# EasyEDA schematic Sheet_1.json
TITLE: Sheet_1; REV: 1.0; Date: 2025-05-09; Sheet: 1/1; Drawn By: ahmadputracahyo; Company: Your Company
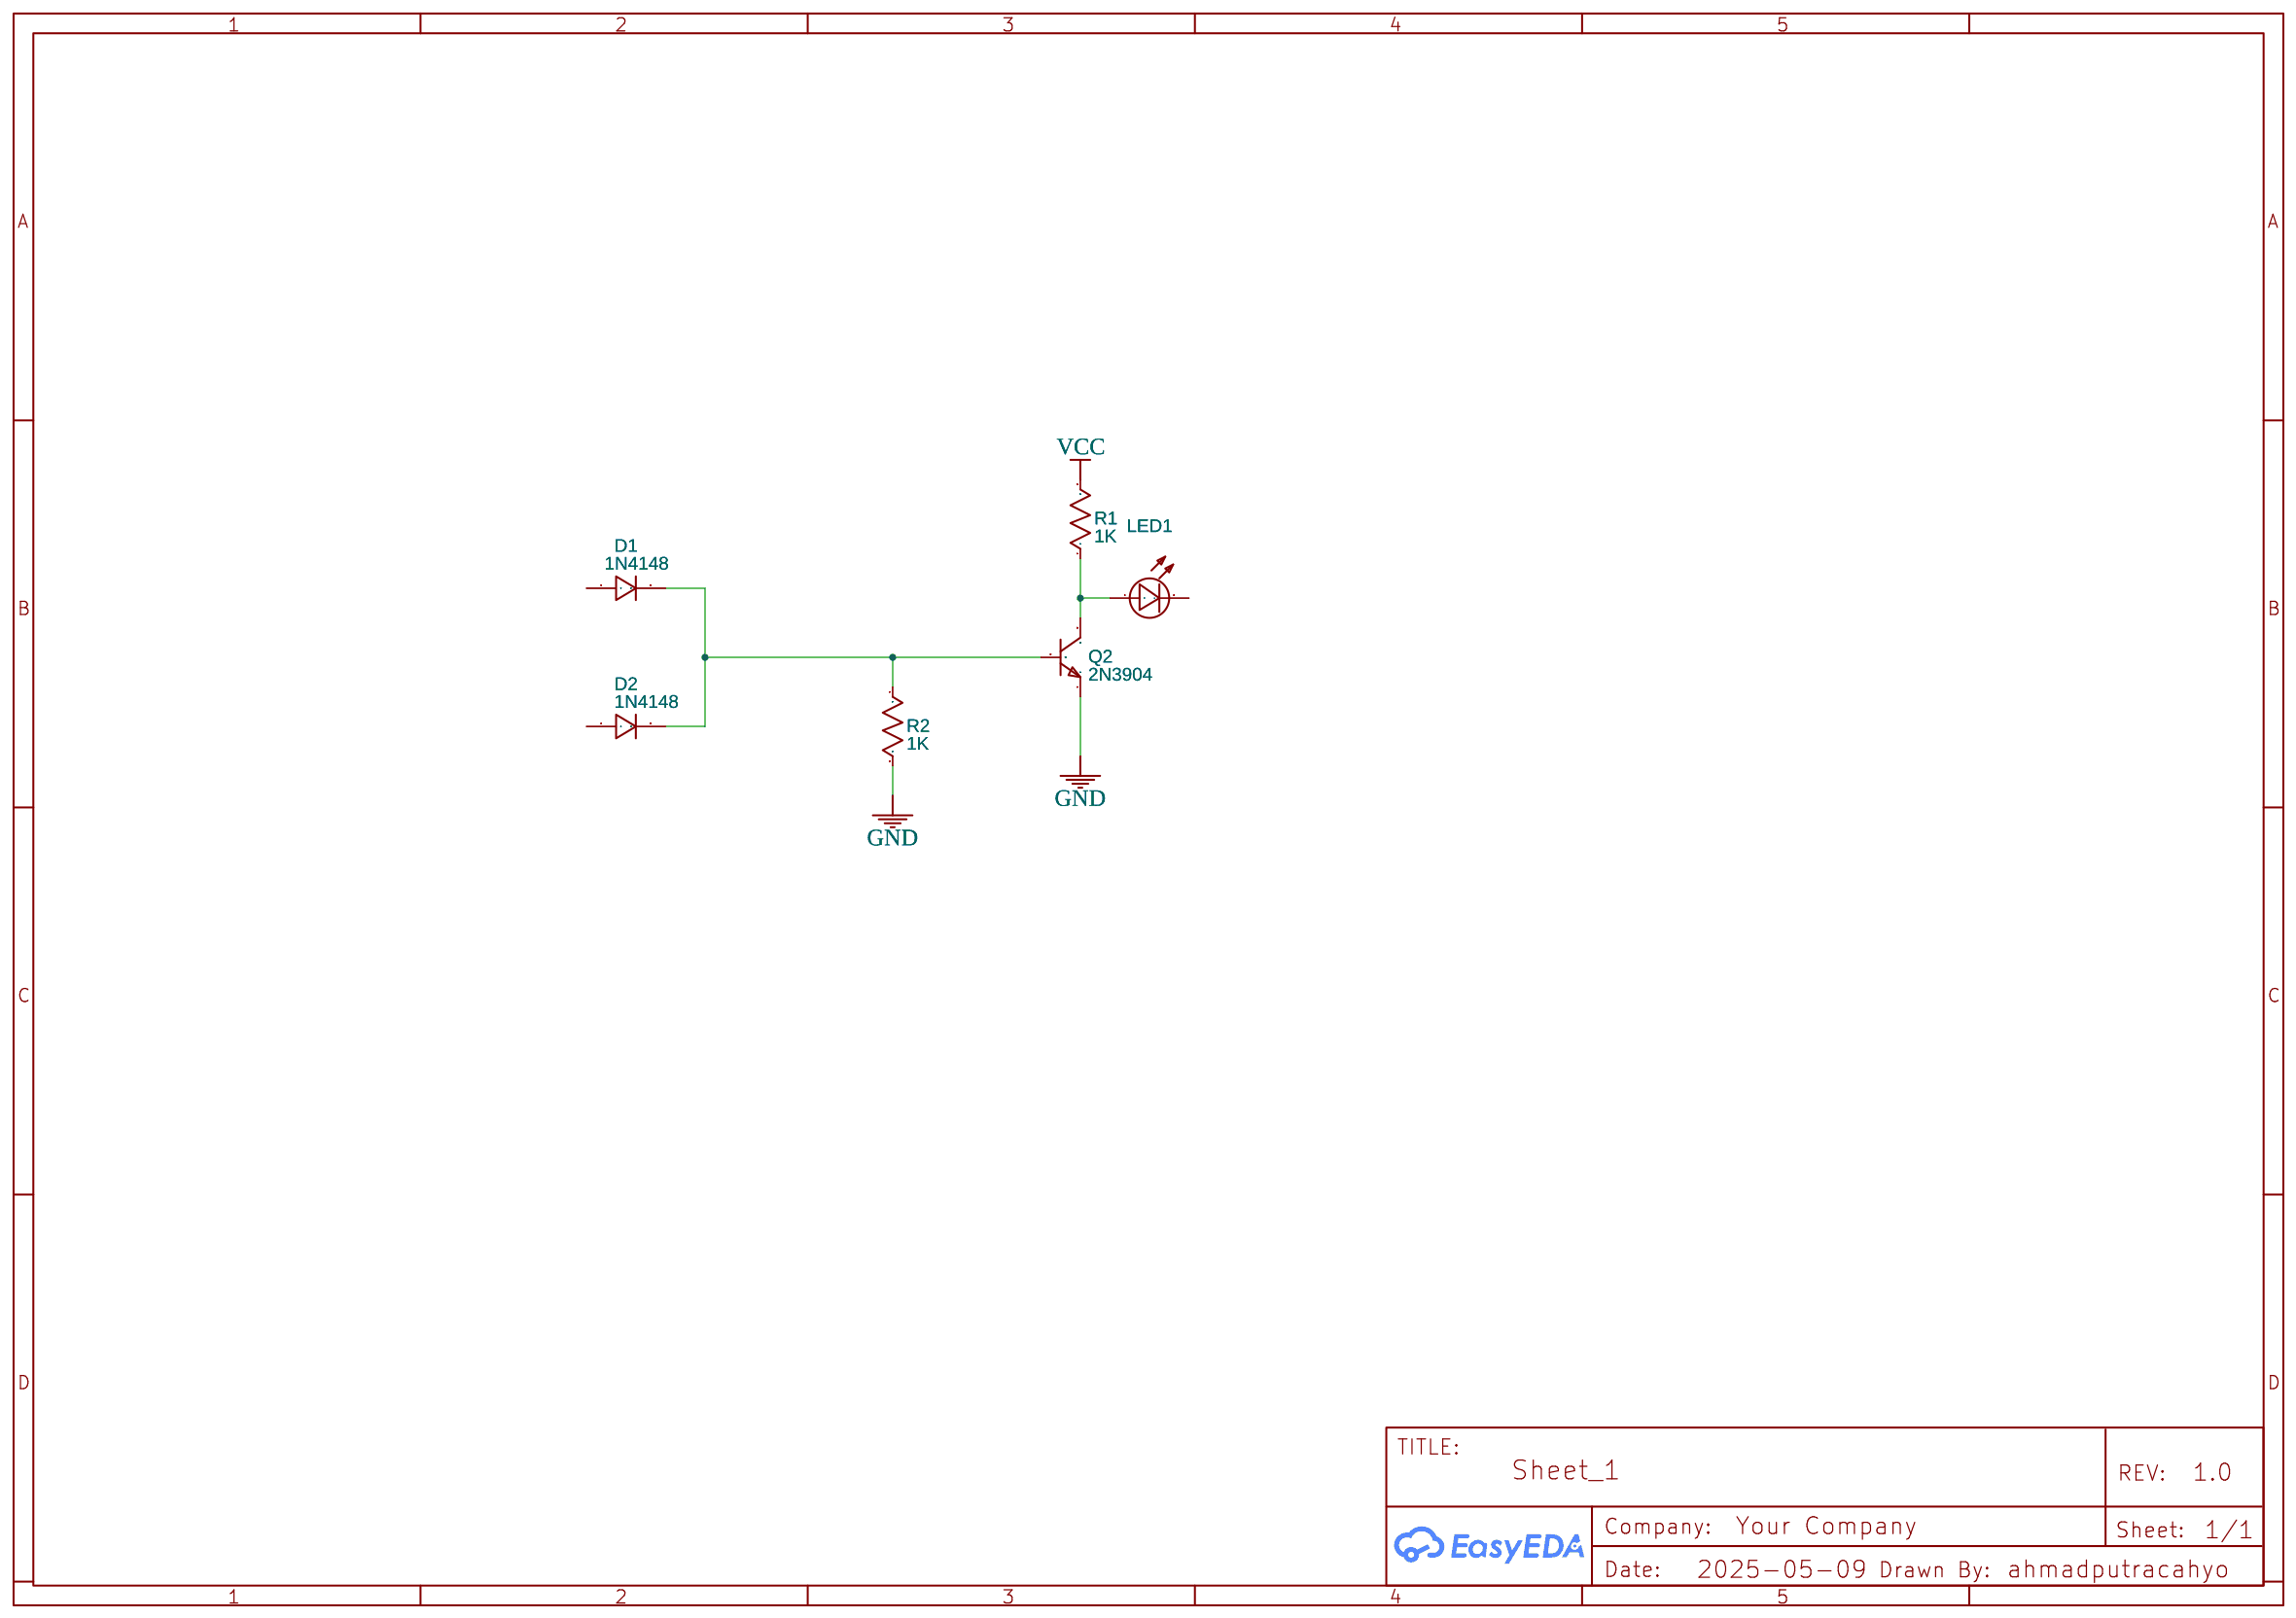
[diagram p0: schematic sheet]

## Parts
D1  1N4148  [DO-35]
D2  1N4148  [DO-35]
LED1  LED
Q2  2N3904  [TO-92-3_L5.1-W4.1-P1.27-L]
R1  1K  [AXIAL-0.3]
R2  1K  [AXIAL-0.3]

## Library data of the parts
D1 D2 = 1N4148: Contributor: EasyEDA
LED1 = LED: catid: 20; Contributor: 仿真库绘制; Color: Red; NameDisplay: 0
Q2 = 2N3904: catid: 20; Contributor: 立创EDA官方封装库; 制造商: ON Semiconductor; sim: true; Supplier: LCSC; Manufacturer: ON Semiconductor; Manufacturer Part: Transistors
R1 R2 = Resistor_US: Resistance: 1k; Contributor: EasyEDA; Supplier: YUJING

## Nets
GND: Q2.1(E) R2.2
VCC: R1.2
Net-(D1-2): D1.2(K) D2.2(K) Q2.2(B) R2.1
Net-(LED1-1): LED1.1(+) Q2.3(C) R1.1

Not connected (* = marked no-connect by the designer): D1 1(A); D2 1(A); LED1 2(-)
